# Altium schematic sheet Comparator.SchDoc
size A4; SheetNumber: 1; SheetTotal: 1
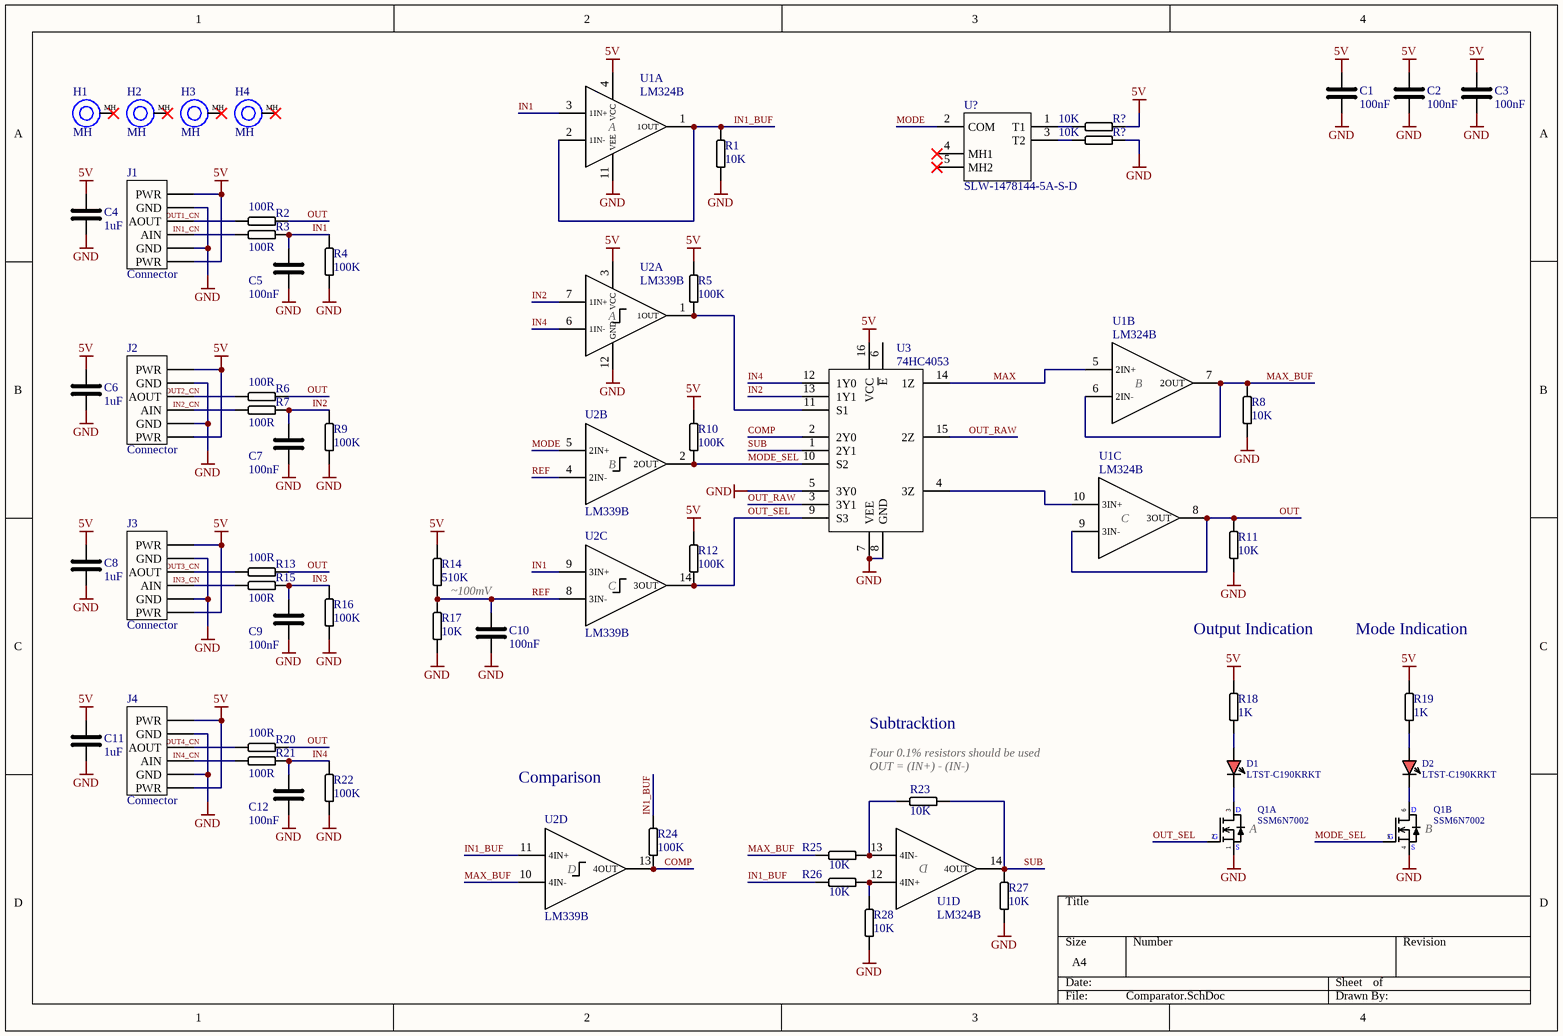
[diagram p0: Comparator.SchDoc]

## Parts
(Parts that share a designator on the sheet are numbered #1, #2 ... from top to bottom, then left to right.)
C1  100nF  [CAP0603]
C2  100nF  [CAP0603]
C3  100nF  [CAP0603]
C4  1uF  [CAP0603]
C5  100nF  [CAP0603]
C6  1uF  [CAP0603]
C7  100nF  [CAP0603]
C8  1uF  [CAP0603]
C9  100nF  [CAP0603]
C10  100nF  [CAP0603]
C11  1uF  [CAP0603]
C12  100nF  [CAP0603]
D1  LTST-C190KRKT  [LED0603]
D2  LTST-C190KRKT  [LED0603]
H1  MH  [MOUNTING_HOLE_M2.5]
H2  MH  [MOUNTING_HOLE_M2.5]
H3  MH  [MOUNTING_HOLE_M2.5]
H4  MH  [MOUNTING_HOLE_M2.5]
J1  Connector  [CONNECTOR]
J2  Connector  [CONNECTOR]
J3  Connector  [CONNECTOR]
J4  Connector  [CONNECTOR]
Q1  SSM6N7002  [SOT-363-6]  (parts A,B of 2)
R1  10K  [RES0603]
R2  100R  [RES0603]
R3  100R  [RES0603]
R4  100K  [RES0603]
R5  100K  [RES0603]
R6  100R  [RES0603]
R7  100R  [RES0603]
R8  10K  [RES0603]
R9  100K  [RES0603]
R10  100K  [RES0603]
R11  10K  [RES0603]
R12  100K  [RES0603]
R13  100R  [RES0603]
R14  510K  [RES0603]
R15  100R  [RES0603]
R16  100K  [RES0603]
R17  10K  [RES0603]
R18  1K  [RES0603]
R19  1K  [RES0603]
R20  100R  [RES0603]
R21  100R  [RES0603]
R22  100K  [RES0603]
R23  10K  [RES0603]
R24  100K  [RES0603]
R25  10K  [RES0603]
R26  10K  [RES0603]
R27  10K  [RES0603]
R28  10K  [RES0603]
R?#1  10K  [RES0603]
R?#2  10K  [RES0603]
U1  LM324B  [TSSOP_14P]  (parts A,B,C,D of 4)
U2  LM339B  [TSSOP_16P]  (parts A,B,C,D of 4)
U3  74HC4053  [TSSOP_16P]
U?  SLW-1478144-5A-S-D  [SWS065-030V12TSK]

## Nets
5V: C1.1 C2.1 C3.1 C4.1 C6.1 C8.1 C11.1 J1.1(PWR) J1.6(PWR) J2.1(PWR) J2.6(PWR) J3.1(PWR) J3.6(PWR) J4.1(PWR) J4.6(PWR) R5.1 R10.1 R12.1 R14.2 R18.1 R19.1 R?#1.2 U1.4(VCC) U2.3(VCC) U3.16(VCC)
GND: C1.2 C2.2 C3.2 C4.2 C5.2 C6.2 C7.2 C8.2 C9.2 C10.2 C11.2 C12.2 J1.2(GND) J1.5(GND) J2.2(GND) J2.5(GND) J3.2(GND) J3.5(GND) J4.2(GND) J4.5(GND) Q1.1(S) Q1.4(S) R1.2 R4.2 R8.2 R9.2 R11.2 R16.2 R17.1 R22.2 R27.1 R28.1 R?#2.2 U1.11(VEE) U2.12(GND) U3.5(3Y0) U3.7(VEE) U3.8(GND)
COMP: R24.2 U2.13(4OUT) U3.2(2Y0)
IN1: C5.1 R3.2 R4.1 U1.3(1IN+) U2.9(3IN+)
IN1_BUF: R1.1 R24.1 R26.2 U1.1(1OUT) U1.2(1IN-) U2.11(4IN+)
IN1_CN: J1.3(AIN) R3.1
IN2: C7.1 R7.2 R9.1 U2.7(1IN+) U3.13(1Y1)
IN2_CN: J2.3(AIN) R7.1
IN3: C9.1 R15.2 R16.1
IN3_CN: J3.3(AIN) R15.1
IN4: C12.1 R21.2 R22.1 U2.6(1IN-) U3.12(1Y0)
IN4_CN: J4.3(AIN) R21.1
MAX: U1.5(2IN+) U3.14(1Z)
MAX_BUF: R8.1 R25.2 U1.6(2IN-) U1.7(2OUT) U2.10(4IN-)
MODE: U2.5(2IN+) U?.2(COM)
MODE_SEL: Q1.5(G) R10.2 U2.2(2OUT) U3.10(S2)
OUT: R2.2 R6.2 R11.1 R13.2 R20.2 U1.8(3OUT) U1.9(3IN-)
OUT1_CN: J1.4(AOUT) R2.1
OUT2_CN: J2.4(AOUT) R6.1
OUT3_CN: J3.4(AOUT) R13.1
OUT4_CN: J4.4(AOUT) R20.1
OUT_RAW: U3.3(3Y1) U3.15(2Z)
OUT_SEL: Q1.2(G) R12.2 U2.14(3OUT) U3.9(S3)
REF: C10.1 R14.1 R17.2 U2.4(2IN-) U2.8(3IN-)
SUB: R23.1 R27.2 U1.14(4OUT) U3.1(2Y1)
NetD1_A: D1.A R18.2
NetD1_C: D1.C Q1.3(D)
NetD2_A: D2.A R19.2
NetD2_C: D2.C Q1.6(D)
NetR5_2: R5.2 U2.1(1OUT) U3.11(S1)
NetR23_2: R23.2 R25.1 U1.13(4IN-)
NetR26_1: R26.1 R28.2 U1.12(4IN+)
NetR?#1_1: R?#1.1 U?.1(T1)
NetR?#2_1: R?#2.1 U?.3(T2)
NetU1_10: U1.10(3IN+) U3.4(3Z)

Not connected (* = marked no-connect by the designer): H1 MH*; H2 MH*; H3 MH*; H4 MH*; U3 6(~{E}); U? 4(MH1)* 5(MH2)*

## Notes on the sheet
- ~100mV
- Output Indication
- Mode Indication
- Comparison
- (near R23) Four 0.1% resistors should be used
- (near R23) OUT = (IN+) - (IN-)
- Subtracktion
- (in symbol LM324BIPWR, part A) A
- (in symbol LM324BIPWR, part B) B
- (in symbol LM324BIPWR, part C) C
- (in symbol LM324BIPWR, part D) D
- (in symbol LM339BIPWR, part A) A
- (in symbol LM339BIPWR, part B) B
- (in symbol LM339BIPWR, part C) C
- (in symbol LM339BIPWR, part D) D
- (in symbol SSM6N7002KFULF, part A) A
- (in symbol SSM6N7002KFULF, part B) B

## Library data of the parts
C1-C12 = Capacitor
H1-H4 = MountingHole
Q1 = SSM6N7002KFULF: Supplier: Mouser; Supplier Part Number: 757-SSM6N7002KFULF
R1-R28 R?#1 R?#2 = Resistor
U1 = LM324BIPWR: Supplier: Mouser; Supplier Part Number: 595-LM324BIPWR
U2 = LM339BIPWR: Supplier: Mouser; Supplier Part Number: 595-LM339BIPWR
U3 = 74HC4053PW,118: Supplier: Mouser; Supplier Part Number: 771-74HC4053PW-T
U? = SWS065-030V12TSK: Supplier: Mouser; Supplier Part Number: 179-SLW14781445ASD
D1 D2 = LTST-C190KRKT: Supplier: Mouser; Supplier Part Number: 859-LTST-C190KRKT